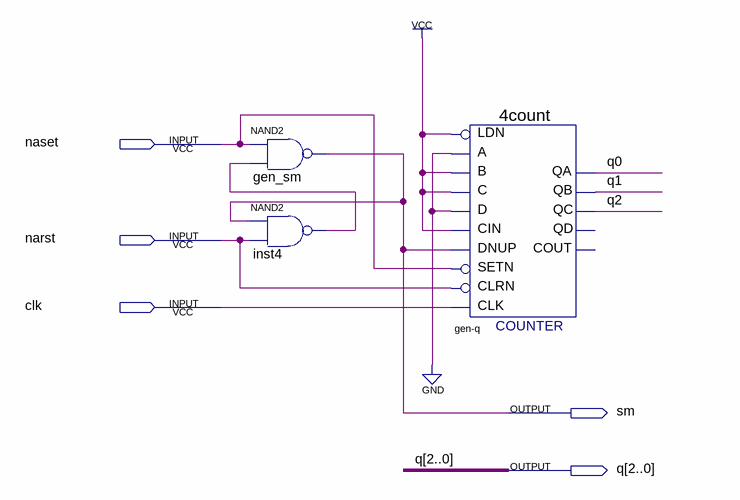
[diagram p0: schematic sheet]
// Quartus schematic on_som.bdf as structural Verilog: 3 symbols, 5 pins
module on_som (
  input  naset,
  input  narst,
  input  clk,
  output sm,
  output [2:0] q
);

  wire inst4_out;

  nand gen_sm (sm, naset, inst4_out);
  nand inst4 (inst4_out, sm, narst);
  \4count  \gen-q  (
    .LDN(1'b1), .B(1'b1), .A(1'b0), .D(1'b0), .CIN(1'b1), .DNUP(sm), .CLK(clk), .SETN(naset), .C(1'b1),
    .CLRN(narst), .QA(q[0]), .QB(q[1]), .QC(q[2]));  // open: QD, COUT
endmodule
